# EAGLE design arduino_Uno_ref (EAGLE 9.6.2)
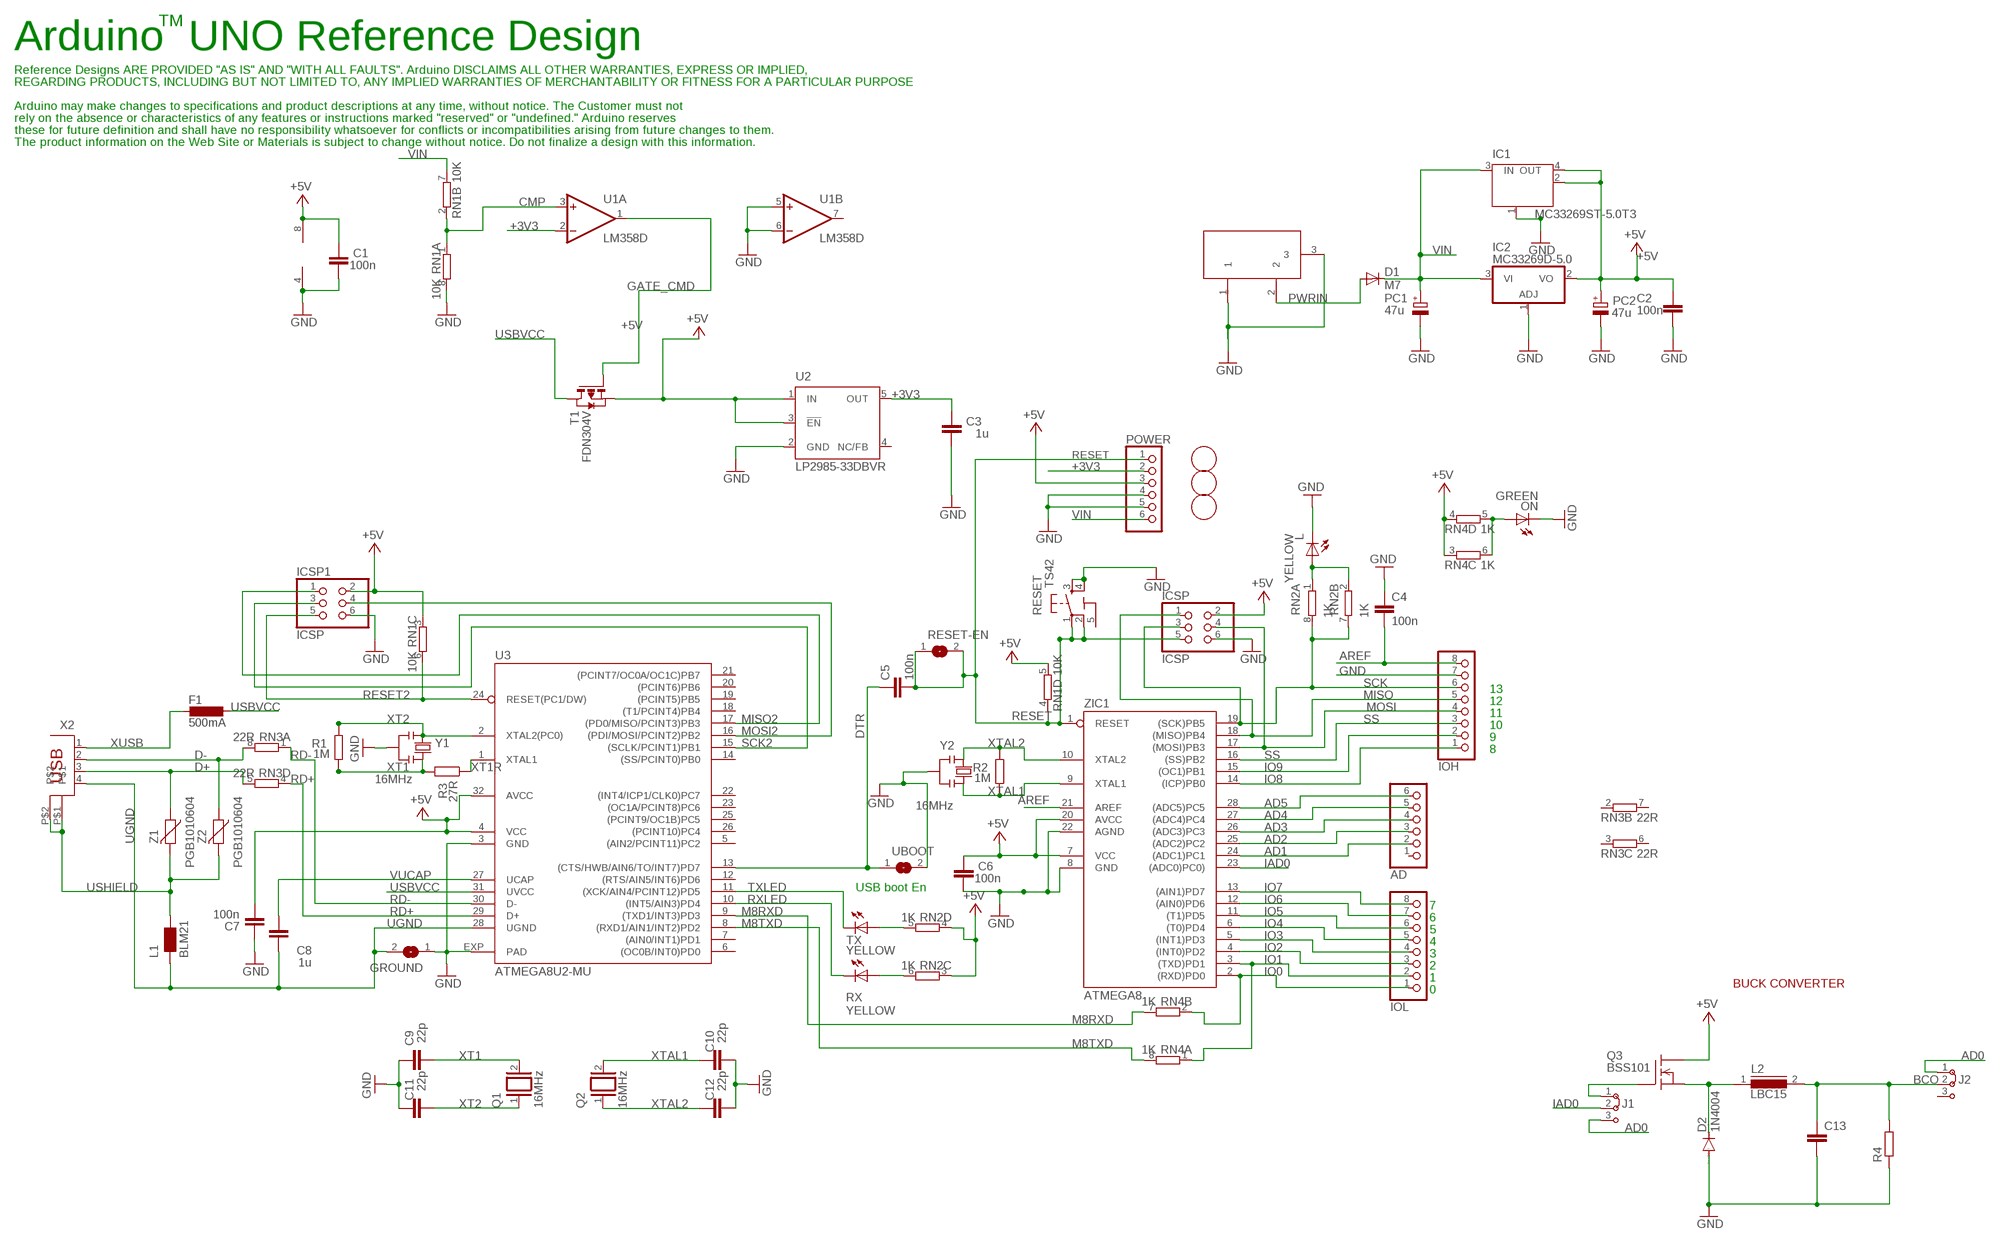
[diagram p0: schematic, sheet 1]

## Parts
AD  PINHD-1X6  [1X06]
C1  100n  C-EU0603-RND  [C0603-ROUND]
C2  100n  C-EU0603-RND  [C0603-ROUND]
C3  1u  C-EU0603-RND  [C0603-ROUND]
C4  100n  C-EU0603-RND  [C0603-ROUND]
C5  100n  C-EU0603-RND  [C0603-ROUND]
C6  100n  C-EU0603-RND  [C0603-ROUND]
C7  100n  C-EU0603-RND  [C0603-ROUND]
C8  1u  C-EU0603-RND  [C0603-ROUND]
C9  22p  C-EU0603-RND  [C0603-ROUND]
C10  22p  C-EU0603-RND  [C0603-ROUND]
C11  22p  C-EU0603-RND  [C0603-ROUND]
C12  22p  C-EU0603-RND  [C0603-ROUND]
C13  C2.5/2  [C2.5-2]
D1  M7  DIODE-SMB  [SMB]
D2  1N4004  [DO41-10]
F1  500mA  L-EUL1812  [L1812]
GROUND  SJ  [SJ]
IC1  MC33269ST-5.0T3  MC33269ST-3.3T3  [SOT223]
IC2  MC33269D-5.0  [DPACK]
ICSP  ICSP  PINHD-2X3  [2X03]
ICSP1  ICSP  PINHD-2X3  [2X03]
IOH  PINHD-1X8  [1X08]
IOL  PINHD-1X8  [1X08]
J1  J2X2MM  [04C]
J2  J2X2MM  [04C]
L  YELLOW  LEDCHIP-LED0805  [CHIP-LED0805]
L1  BLM21  WE-CBF_0805  [0805]
L2  LBC15  [LBC15]
ON  GREEN  LEDCHIP-LED0805  [CHIP-LED0805]
PC1  47u  CPOL-EUD  [PANASONIC_D]
PC2  47u  CPOL-EUD  [PANASONIC_D]
POWER  PINHD-1X6  [1X06]
Q1  16MHz  XTAL/S  [QS]
Q2  16MHz  XTAL/S  [QS]
Q3  BSS101  [TO92]
R1  1M  R-EU_R0603  [R0603-ROUND]
R2  1M  R-EU_R0603  [R0603-ROUND]
R3  27R  R-EU_R0603  [R0603-ROUND]
R4  R-EU_0207/10  [0207/10]
RESET  TS42  [TS42]
RESET-EN  SJ  [SJ]
RN1  10K  4R-NCAY16  [CAY16]
RN2  1K  4R-NCAY16  [CAY16]
RN3  22R  4R-NCAY16  [CAY16]
RN4  1K  4R-NCAY16  [CAY16]
RX  YELLOW  LEDCHIP-LED0805  [CHIP-LED0805]
T1  FDN304V  PMOSSOT23  [SOT-23]
TX  YELLOW  LEDCHIP-LED0805  [CHIP-LED0805]
U1  LM358D  [SO08]
U2  LP2985-33DBVR  TPS77033  [SOT23-DBV]
U3  ATMEGA8U2-MU  [QFN32]
U$3  FIDUCIALMOUNT  [FIDUCIA-MOUNT]
U$4  FIDUCIALMOUNT  [FIDUCIA-MOUNT]
U$6  FIDUCIALMOUNT  [FIDUCIA-MOUNT]
UBOOT  SJ  [SJ]
X1  DC21MMX  [DC-21MM]
X2  PN61729  [PN61729]
Y1  16MHz  RESONATORMU  [RESONATOR]
Y2  16MHz  RESONATORMU  [RESONATOR]
Z1  PGB1010604  VARISTORCN0603  [CT/CN0603]
Z2  PGB1010604  VARISTORCN0603  [CT/CN0603]
ZIC1  ATMEGA8  AT90S4433P  [DIL28-3]

## Nets
+3V3: C3.2 POWER.2 U1.2(A:-IN) U2.5(OUT)
+5V: C1.2 C2.2 C6.2 C7.1 IC1.2(OUT) IC1.4(OUT) IC2.2(VO) ICSP1.2 ICSP.2 PC2.+ POWER.3 Q3.3(D) RN1.3 RN1.5 RN2.3 RN2.4 RN4.3 RN4.4 T1.2(S) U1.8(P:V+) U2.1(IN) U2.3(!EN) U3.4(VCC) U3.32(AVCC) ZIC1.7(VCC) ZIC1.20(AVCC)
AD0: J1.3 J2.1
AD1: AD.2 ZIC1.24((ADC1)PC1)
AD2: AD.3 ZIC1.25((ADC2)PC2)
AD3: AD.4 ZIC1.26((ADC3)PC3)
AD4: AD.5 ZIC1.27((ADC4)PC4)
AD5: AD.6 ZIC1.28((ADC5)PC5)
AREF: C4.2 IOH.8 ZIC1.21(AREF)
BCO: C13.1 J2.2 L2.2 R4.2
CMP: RN1.1 RN1.2 U1.3(A:+IN)
D+: RN3.5 X2.3 Z1.1
D-: RN3.8 X2.2 Z2.1
DTR: C5.1 U3.13((CTS/HWB/AIN6/TO/INT7)PD7) UBOOT.1
GATE_CMD: T1.3(G) U1.1(A:OUT)
GND: C1.1 C2.1 C3.1 C4.1 C6.1 C7.2 C9.2 C10.1 C11.2 C12.1 C13.2 D2.A GROUND.1 IC1.1(GND/ADJ) IC2.1(ADJ) ICSP1.6 ICSP.6 IOH.7 L.C ON.C PC1.- PC2.- POWER.4 POWER.5 R4.1 RESET.3 RESET.4 RN1.8 U1.4(P:V-) U1.5(B:+IN) U1.6(B:-IN) U2.2(GND) U3.3(GND) U3.EXP(PAD) UBOOT.2 X1.1 X1.3 Y1.2 Y2.2 ZIC1.8(GND) ZIC1.22(AGND)
IAD0: J1.2 ZIC1.23((ADC0)PC0))
IO0: IOL.1 RN4.2 ZIC1.2((RXD)PD0)
IO1: IOL.2 RN4.1 ZIC1.3((TXD)PD1)
IO2: IOL.3 ZIC1.4((INT0)PD2)
IO3: IOL.4 ZIC1.5((INT1)PD3)
IO4: IOL.5 ZIC1.6((T0)PD4)
IO5: IOL.6 ZIC1.11((T1)PD5)
IO6: IOL.7 ZIC1.12((AIN0)PD6)
IO7: IOL.8 ZIC1.13((AIN1)PD7)
IO8: IOH.1 ZIC1.14((ICP)PB0)
IO9: IOH.2 ZIC1.15((OC1)PB1)
M8RXD: RN4.7 U3.9((TXD1/INT3)PD3)
M8TXD: RN4.8 U3.8((RXD1/AIN1/INT2)PD2)
MISO: ICSP.1 IOH.5 ZIC1.18((MISO)PB4)
MISO2: ICSP1.1 U3.17((PD0/MISO/PCINT3)PB3)
MOSI: ICSP.4 IOH.4 ZIC1.17((MOSI)PB3)
MOSI2: ICSP1.4 U3.16((PDI/MOSI/PCINT2)PB2)
N$1: J1.1 Q3.2(G)
N$2: L.A RN2.1 RN2.2
N$3: ON.A RN4.5 RN4.6
N$5: D2.C L2.1 Q3.1(S)
N$35: RN2.6 RX.A
N$36: RN2.5 TX.A
PWRIN: D1.A X1.2
RD+: RN3.4 U3.29(D+)
RD-: RN3.1 U3.30(D-)
RESET: C5.2 ICSP.5 POWER.1 RESET-EN.1 RESET-EN.2 RESET.1 RESET.2 RN1.4 ZIC1.1(RESET)
RESET2: ICSP1.5 RN1.6 U3.24(RESET(PC1/DW))
RXLED: RX.C U3.10((INT5/AIN3)PD4)
SCK: ICSP.3 IOH.6 RN2.7 RN2.8 ZIC1.19((SCK)PB5)
SCK2: ICSP1.3 U3.15((SCLK/PCINT1)PB1)
SS: IOH.3 ZIC1.16((SS)PB2)
TXLED: TX.C U3.11((XCK/AIN4/PCINT12)PD5)
UGND: C8.2 GROUND.2 L1.1 U3.28(UGND) X2.4
USBVCC: F1.1 T1.1(D) U3.31(UVCC)
USHIELD: L1.2 X2.P$1 X2.P$2 Z1.2 Z2.2
VIN: D1.C IC1.3(IN) IC2.3(VI) PC1.+ POWER.6 RN1.7
VUCAP: C8.1 U3.27(UCAP)
XT1: C9.1 Q1.2 R1.1 R3.2 Y1.3
XT1R: R3.1 U3.1(XTAL1)
XT2: C11.1 Q1.1 R1.2 U3.2(XTAL2(PC0)) Y1.1
XTAL1: C10.2 Q2.2 R2.1 Y2.3 ZIC1.9(XTAL1)
XTAL2: C12.2 Q2.1 R2.2 Y2.1 ZIC1.10(XTAL2)
XUSB: F1.2 X2.1
Unconnected: AD.1 J2.3 RN3.2 RN3.3 RN3.6 RN3.7 U1.7(B:OUT) U2.4(NC/FB) U3.5((AIN2/PCINT11)PC2) U3.6((OC0B/INT0)PD0) U3.7((AIN0/INT1)PD1) U3.12((RTS/AIN5/INT6)PD6) U3.14((SS/PCINT0)PB0) U3.18((T1/PCINT4)PB4) U3.19((PCINT5)PB5) U3.20((PCINT6)PB6) U3.21((PCINT7/OC0A/OC1C)PB7) U3.22((INT4/ICP1/CLK0)PC7) U3.23((OC1A/PCINT8)PC6) U3.25((PCINT9/OC1B)PC5) U3.26((PCINT10)PC4)

## Notes on the sheet
- TM
- Arduino  UNO Reference Design
- Reference Designs ARE PROVIDED "AS IS" AND "WITH ALL FAULTS". Arduino DISCLAIMS ALL OTHER WARRANTIES, EXPRESS OR IMPLIED,
- REGARDING PRODUCTS, INCLUDING BUT NOT LIMITED TO, ANY IMPLIED WARRANTIES OF MERCHANTABILITY OR FITNESS FOR A PARTICULAR PURPOSE
- Arduino may make changes to specifications and product descriptions at any time, without notice. The Customer must not
- rely on the absence or characteristics of any features or instructions marked "reserved" or "undefined." Arduino reserves
- these for future definition and shall have no responsibility whatsoever for conflicts or incompatibilities arising from future changes to them.
- The product information on the Web Site or Materials is subject to change without notice. Do not finalize a design with this information.
- 13
- 12
- 11
- 10
- 9
- 8
- USB boot En
- 7
- 6
- 5
- 4
- 3
- 2
- 1
- BUCK CONVERTER
- 0

## Power pins joined to a net without a drawn wire
5-GND: RESET.5(5-GND)

## Library data of the parts
AD POWER = pinhead:PINHD-1X6: PIN HEADER
C1-C12 = SmartPrj:C-EU: CAPACITOR, European symbol
C13 = capacitor-wima:C: CAPACITOR naming: grid - package width
D1 = diode:DIODE-: DIODE
D2 = diode:1N4004: DIODE general purpose rectifier, 1 A
F1 = rcl:L-EU: INDUCTOR, European symbol
GROUND RESET-EN UBOOT = jumper:SJ: SMD solder JUMPER
IC1 = linear:MC33269ST*: Adjustable Output Low Dropout Voltage Regulator 800 mA Source: http://www.onsemi.com/pub/Collateral/MC33269-D.PDF
IC2 = linear:MC33269?*: Adjustable Output Low Dropout Voltage Regulator 800 mA Source: http://www.onsemi.com/pub/Collateral/MC33269-D.PDF
ICSP ICSP1 = pinhead:PINHD-2X3: PIN HEADER
IOH IOL = pinhead:PINHD-1X8: PIN HEADER
J1 J2 = jumper:J2: Jumper switch 2 x 2.5 mm
L ON RX TX = led:LED: LED OSRAM: - CHIPLED LG R971, LG N971, LY N971, LG Q971, LY Q971, LO R971, LY R971 LH N974, LH R974 LS Q976, LO Q976, LY Q976 LO Q996 - Hyper CHIPLED LW Q18S LB Q993, LB Q99A, LB R99A - SideLED LS A670, LO A670, LY A670, LG A670, LP A670 LB A673, LV A673, LT A673, LW A673 LH A674 LY A675 LS A676, LA A676, LO A676, LY A676, LW A676 LS A679, LY A679, LG A679 - Hyper Micro SIDELED® LS Y876, LA Y876, LO Y876, LY Y876 LT Y87S - SmartLED LW L88C, LW L88S LB L89C, LB L89S, LG L890 LS L89K, LO L89K, LY L89K LS L896, LA L896, LO L896, LY L896 - TOPLED LS T670, LO T670, LY T670, LG T670, LP T670 LSG T670, LSP T670, LSY T670, LOP T670, LYG T670 LG T671, LOG T671, LSG T671 LB T673, LV T673, LT T673, LW T673 LH T674 LS T676, LA T676, LO T676, LY T676, LB T676, LH T676, LSB T676, LW T676 LB T67C, LV T67C, LT T67C, LS T67K, LO T67K, LY T67K, LW E67C LS E67B, LA E67B, LO E67B, LY E67B, LB E67C, LV E67C, LT E67C LW T67C LS T679, LY T679, LG T679 LS T770, LO T770, LY T770, LG T770, LP T770 LB T773, LV T773, LT T773, LW T773 LH T774 LS E675, LA E675, LY E675, LS T675 LS T776, LA T776, LO T776, LY T776, LB T776 LHGB T686 LT T68C, LB T68C - Hyper Mini TOPLED® LB M676 - Mini TOPLED Santana® LG M470 LS M47K, LO M47K, LY M47K Source: http://www.osram.convergy.de LUXEON: - LUMILED® LXK2-PW12-R00, LXK2-PW12-S00, LXK2-PW14-U00, LXK2-PW14-V00 LXK2-PM12-R00, LXK2-PM12-S00, LXK2-PM14-U00 LXK2-PE12-Q00, LXK2-PE12-R00, LXK2-PE12-S00, LXK2-PE14-T00, LXK2-PE14-U00 LXK2-PB12-K00, LXK2-PB12-L00, LXK2-PB12-M00, LXK2-PB14-N00, LXK2-PB14-P00, LXK2-PB14-Q00 LXK2-PR12-L00, LXK2-PR12-M00, LXK2-PR14-Q00, LXK2-PR14-R00 LXK2-PD12-Q00, LXK2-PD12-R00, LXK2-PD12-S00 LXK2-PH12-R00, LXK2-PH12-S00 LXK2-PL12-P00, LXK2-PL12-Q00, LXK2-PL12-R00 Source: www.luxeon.com KINGBRIGHT: KA-3528ASYC Source: www.kingbright.com
L1 = wuerth-elektronik:WE-CBF: SMD EMI Suppression Ferrite Beads - excellent anti-EMI properties - low DCR - impedances till 3000 ohms - rated current up to 6 A
L2 = inductors:LBC15: INDUCTOR; SPICEPREFIX: L
PC1 PC2 = rcl:CPOL-EU: POLARIZED CAPACITOR, European symbol
Q1 Q2 = special:XTAL/S: CRYSTAL
Q3 = transistor-fet:BSS101: N-Channel Enhancement MOSFET 200V; 0,16A; 11Ohm
R1-R3 = SmartPrj:R-EU_: RESISTOR, European symbol
R4 = rcl:R-EU_: RESISTOR, European symbol; SPICEPREFIX: R
RESET = st-mod v1.4:TS42: TS42 Dongnan Electronics Tact switch VDC 12V - 50mA
RN1-RN4 = resistor-dil:4R-N: Array Chip Resistor Source: RS Component / Phycomp
T1 = zetex:PMOSSOT23: MOS FET
U1 = linear:LM358: OP AMP also LM158; LM258; LM2904 Source: http://cache.national.com/ds/LM/LM158.pdf
U2 = texas:TPS770*: ULTRALOW-POWER 50-mA LOW-DROPOUT LINEAR REGULATORS 50-mA Low-Dropout Regulator Source: http://focus.ti.com/lit/ds/symlink/tps77001.pdf
U3 = atmel:ATMEGA8U2-MU
U$3 U$4 U$6 = SmartPrj:FIDUCIALMOUNT
X1 = powersupply:DC21MM
X2 = SmartPrj:PN61729: BERG USB connector
Y1 Y2 = SmartPrj:RESONATOR
Z1 Z2 = varistor:VARISTOR: VARISTOR
ZIC1 = atmel:AT90S4433: MICROCONTROLLER 4 Kbytes FLASH 128 bytes SRAM 256 bytes EEPROM UART 6-channel 10 bit ADC

## Net classes
0 default: width 0.152 mm, drill 0.305 mm, clearance 0.152 mm
2 gnd: width 0.305 mm, drill 0.483 mm, clearance 0.203 mm
3 usbvcc: width 0.305 mm, drill 0.483 mm, clearance 0.203 mm

## Board
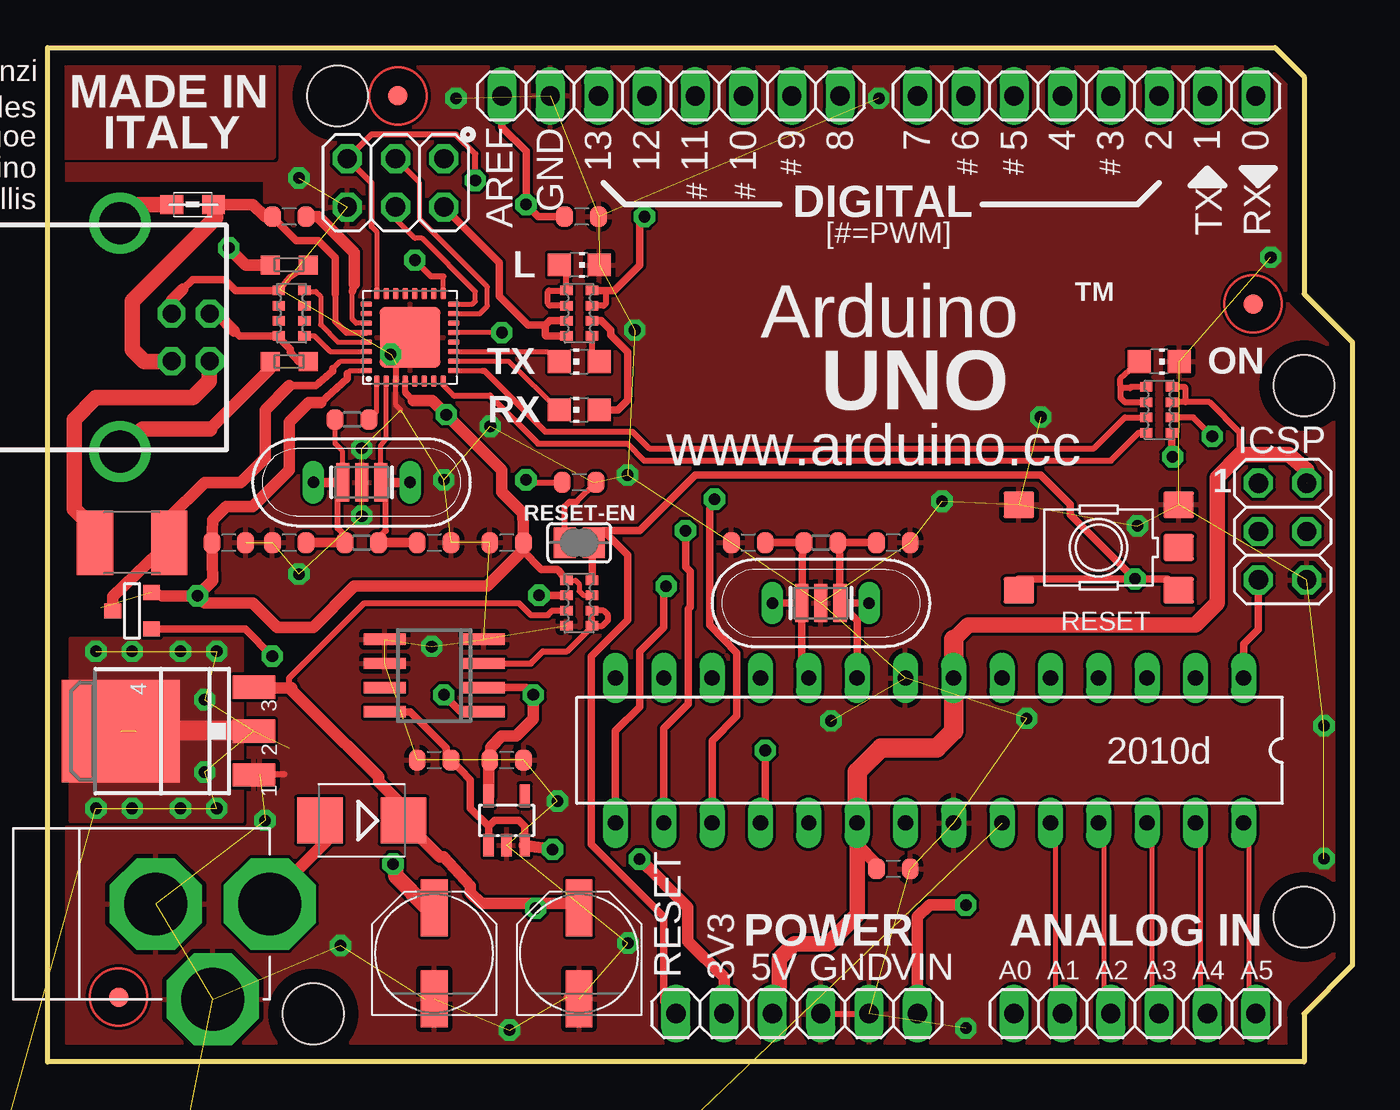
[diagram p1: board, top side]
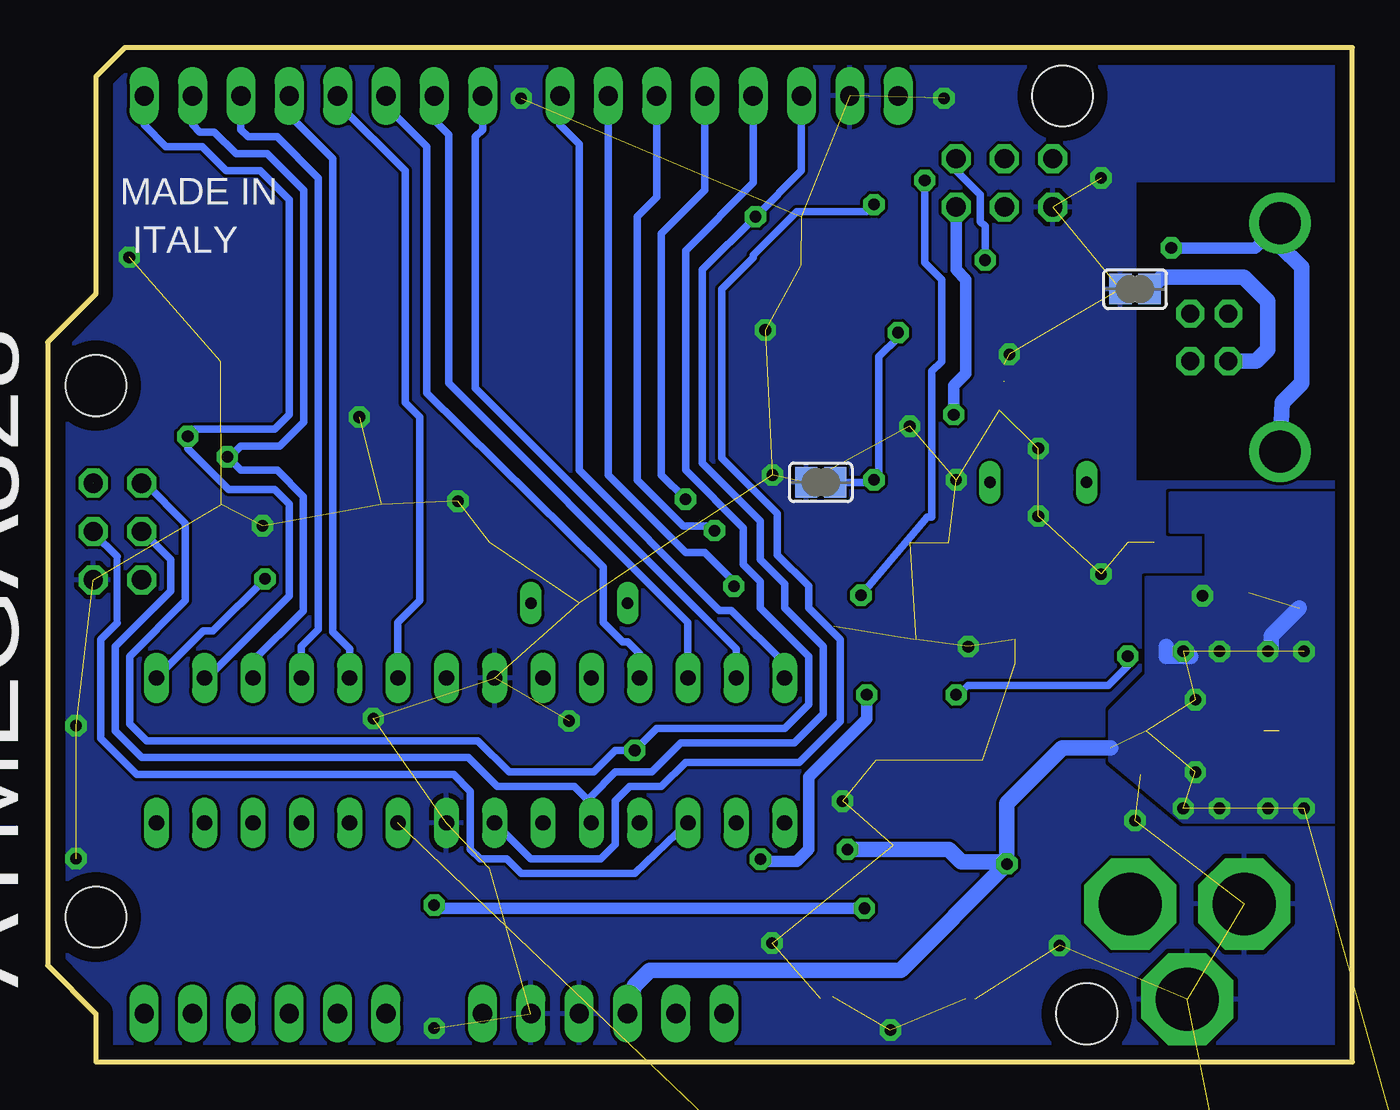
[diagram p2: board, bottom side, seen from below]

Size 68.58 x 53.34 mm. Coordinates in mm from the lower left corner, seen from the top.
Outline: 0,53.34 64.52,53.34 66.04,51.82 66.04,40.39 68.58,37.85 68.58,5.08 66.04,2.54 66.04,0 0,0 0,53.34
Copper layers (1*16): Top 0.035mm / dielectric 1.5mm / Bottom 0.035mm
Design rules "default *": minimum track width 8mil, minimum drill 12mil, track to track 6mil, track to pad 6mil, pad to pad 6mil, via to via 6mil, smd to smd 6mil, copper to edge 30mil, drill to drill 12mil, minimum pad ring 10mil, minimum via ring 10mil, stop-mask expansion 1mil, vias tented up to drill 0mil, thermal gap 10mil
Holes 3.2 mm at 66.04,35.56 66.04,7.62 15.24,50.8 13.97,2.54
vRestrict: area 0.6,21.8 to 2,30.1; area 5.7,22.6 to 7.4,30.1; area 47.9,10.3 to 48.5,10.8; area 50.4,10.2 to 50.9,11; area 11.3,28.8 to 12.7,31.1; area 0.3,12.4 to 9.4,24.5

### Footprints (pad centres in the part's own frame; a part is rotated, then mirrored left to right if it is on the bottom)
1X06 = drill 1.016 long: 1 -6.35,0; 2 -3.81,0; 3 -1.27,0; 4 1.27,0; 5 3.81,0; 6 6.35,0
C0603-ROUND = smd 0.898 x 1.1: 1 -0.889,0; 2 0.889,0
C2.5-2 = drill 0.813 pad 1.6 octagon: 1 -1.27,0; 2 1.27,0
SMB = smd 2.4 x 2.4: A 2.2,0; C -2.2,0
DO41-10 = drill 1.118: A 5.08,0; C -5.08,0
L1812 = smd 1.9 x 3.4: 1 -1.95,0; 2 1.95,0
SJ = smd 1.168 x 1.6: 1 -0.762,0; 2 0.762,0
SOT223 = smd 1.219 x 2.235: 1 -2.311,-3.099; 2 0,-3.099; 3 2.311,-3.099 | smd 3.6 x 2.2: 4 0,3.099
DPACK = smd 1 x 1.6: 1 -2.28,-4.8; 3 2.28,-4.8 | smd 5.4 x 6.2: 2 0,2.5
2X03 = drill 1.016 octagon: 1 -2.54,-1.27; 2 -2.54,1.27; 3 0,-1.27; 4 0,1.27; 5 2.54,-1.27; 6 2.54,1.27
1X08 = drill 1.016 long: 1 -8.89,0; 2 -6.35,0; 3 -3.81,0; 4 -1.27,0; 5 1.27,0; 6 3.81,0; 7 6.35,0; 8 8.89,0
04C = drill 0.813 pad 1.905 octagon: 1 -1.905,0; 2 1.905,0; 3 5.715,0
CHIP-LED0805 = smd 1.2 x 1.2: A 0,-1.05; C 0,1.05
0805 = smd 1.2 x 1: 1 -1.1,0; 2 1.1,0
LBC15 = drill 0.914 long: 1 -7.62,0; 2 7.62,0
PANASONIC_D = smd 3 x 1.4: + 2.4,0; - -2.4,0
QS = drill 0.61 long: 1 -2.54,0; 2 2.54,0
TO92 = drill 0.813 octagon: 1 1.27,0; 2 0,1.905; 3 -1.27,0
R0603-ROUND = smd 0.898 x 1.1: 1 -0.889,0; 2 0.889,0
0207/10 = drill 0.813 octagon: 1 -5.08,0; 2 5.08,0
TS42 = smd 1.6 x 1.4: 1 -4.2,2.25; 2 4.2,2.25; 3 -4.2,-2.25; 4 4.2,-2.25; 5 -4.2,0
CAY16 = smd 0.5 x 0.65: 1 -1.2,-0.675; 2 -0.4,-0.675; 3 0.4,-0.675; 4 1.2,-0.675; 5 1.2,0.675; 6 0.4,0.675; 7 -0.4,0.675; 8 -1.2,0.675
SOT-23 = smd 0.787 x 0.889: 1 0.025,-1.016; 2 -0.94,1.016; 3 0.991,1.016
SO08 = smd 0.6 x 2.2: 1 -1.905,-2.6; 2 -0.635,-2.6; 3 0.635,-2.6; 4 1.905,-2.6; 5 1.905,2.6; 6 0.635,2.6; 7 -0.635,2.6; 8 -1.905,2.6
SOT23-DBV = smd 0.55 x 1.2: 1 -0.95,-1.3; 2 0,-1.3; 3 0.95,-1.3; 4 0.95,1.3; 5 -0.95,1.3
QFN32 = smd 0.6 x 0.3: 1 -2.3,1.75; 2 -2.3,1.25; 3 -2.3,0.75; 4 -2.3,0.25; 5 -2.3,-0.25; 6 -2.3,-0.75; 7 -2.3,-1.25; 8 -2.3,-1.75; 17 2.3,-1.75; 18 2.3,-1.25; 19 2.3,-0.75; 20 2.3,-0.25; 21 2.3,0.25; 22 2.3,0.75; 23 2.3,1.25; 24 2.3,1.75 | smd 0.3 x 0.6: 9 -1.75,-2.3; 10 -1.25,-2.3; 11 -0.75,-2.3; 12 -0.25,-2.3; 13 0.25,-2.3; 14 0.75,-2.3; 15 1.25,-2.3; 16 1.75,-2.3; 25 1.75,2.3; 26 1.25,2.3; 27 0.75,2.3; 28 0.25,2.3; 29 -0.25,2.3; 30 -0.75,2.3; 31 -1.25,2.3; 32 -1.75,2.3 | smd 3.2 x 3.2: EXP 0,0
FIDUCIA-MOUNT = smd 1.016 x 1.016: P$1 0,0
DC-21MM = drill 3.302 pad 4.826 octagon: 1 -5.08,-3.353; 2 -0.076,-6.35; 3 -0.076,-0.356
PN61729 = drill 0.95 octagon: 1 1.25,4.71; 2 -1.25,4.71; 3 -1.25,2.71; 4 1.25,2.71 | drill 2.2: P$1 -6,0; P$2 6,0
RESONATOR = smd 0.7 x 2: 1 -1,0; 2 0,0; 3 1,0
CT/CN0603 = smd 1 x 1: 1 -1,0; 2 1,0
DIL28-3 = drill 0.813 long: 1 -16.51,-3.81; 2 -13.97,-3.81; 3 -11.43,-3.81; 4 -8.89,-3.81; 5 -6.35,-3.81; 6 -3.81,-3.81; 7 -1.27,-3.81; 8 1.27,-3.81; 9 3.81,-3.81; 10 6.35,-3.81; 11 8.89,-3.81; 12 11.43,-3.81; 13 13.97,-3.81; 14 16.51,-3.81; 15 16.51,3.81; 16 13.97,3.81; 17 11.43,3.81; 18 8.89,3.81; 19 6.35,3.81; 20 3.81,3.81; 21 1.27,3.81; 22 -1.27,3.81; 23 -3.81,3.81; 24 -6.35,3.81; 25 -8.89,3.81; 26 -11.43,3.81; 27 -13.97,3.81; 28 -16.51,3.81

### Placement (x,y rotation side)
AD  57.15,2.54 0 top
C1  20.32,15.88 0 top
C2  9.53,27.3 180 top
C3  24.13,15.88 180 top
C4  28.07,44.45 180 top
C5  27.94,30.48 0 top
C6  44.45,10.16 180 top
C7  24.13,27.3 180 top
C8  12.7,44.45 180 top
C9  12.7,27.3 180 top
C10  44.45,27.3 180 top
C11  20.32,27.3 0 top
C12  36.83,27.3 0 top
C13  1.27,-27.3 0 top  (outside the outline)
D1  16.51,12.7 180 top
D2  -7.62,-27.3 0 top  (outside the outline)
F1  4.45,27.3 180 top
GROUND  11.43,40.64 0 bottom
IC1  7.75,17.4 90 top
IC2  6.35,17.4 90 top
ICSP  64.91,27.89 270 top
ICSP1  18.29,46.23 180 top
IOH  32.77,50.8 180 top
IOL  54.61,50.8 180 top
J1  -10.79,-43.81 0 top  (outside the outline)
J2  -10.79,-48.26 0 top  (outside the outline)
L  27.94,41.91 270 top
L1  7.62,45.09 180 top
L2  -4.45,-20.95 0 top  (outside the outline)
ON  58.42,36.83 270 top
PC1  27.94,5.71 90 top
PC2  20.32,5.71 90 top
POWER  39.37,2.54 0 top
Q1  16.51,30.48 180 top
Q2  40.64,24.13 0 top
Q3  -10.79,-38.73 0 top  (outside the outline)
R1  16.51,27.3 0 top
R2  40.64,27.3 180 top
R3  16,33.78 180 top
R4  -7.62,-34.29 0 top  (outside the outline)
RESET  55.24,27.05 180 top
RESET-EN  27.94,27.3 0 top
RN1  27.94,24.13 90 top
RN2  27.94,39.37 270 top
RN3  12.83,39.37 90 top
RN4  58.42,34.29 90 top
RX  27.94,34.29 90 top
T1  4.45,23.75 270 top
TX  27.94,36.83 90 top
U1  20.32,20.32 90 top
U2  24.13,12.7 0 top
U3  19.05,38.1 90 top
U$3  18.41,50.8 0 top
U$4  63.37,39.85 0 top
U$6  3.73,3.41 0 top
UBOOT  27.94,30.48 180 bottom
X1  5.33,8.38 90 top
X2  3.81,38.1 270 top
Y1  16.51,30.48 180 top
Y2  40.64,24.13 0 top
Z1  12.7,41.91 180 top
Z2  12.7,36.83 180 top
ZIC1  46.35,16.38 180 top

### Tracks (layer width: path | path; a pad name or v marks a point on that pad's centre or on a via)
+3V3  (via drill 0.61)
  Top 0.406: U1.2 25.15,19.68 v25.53,19.3
  Top 0.61: POWER.2 35.56,4.45 33.66,6.35 33.66,8.13 v31.11,10.67 31.62,10.16 | U2.5 23.18,15.78 C3.2 23.28,16.55 23.88,17.14 24.64,17.14 25.53,18.03 v25.53,19.3
  Bottom 0.61: v31.11,10.67 30.99,10.54 29.21,10.54 28.57,11.18 28.57,14.99 25.53,18.03 v25.53,19.3
+5V  (via drill 0.61)  (15 unrouted)
  Top 0.254: U3.32 15.9,36.35 15.75,36.2 | RN1.3 28.18,24.53 27.94,24.77 27.94,25.15 27.76,25.33 RN1.5
  Top 0.305: 18.8,35.2 U3.4 | 59.82,34.69 61.07,34.69 62.66,33.1 62.66,31.93 | 59.82,34.69 RN4.3 | RN4.4 59.76,35.49 59.82,35.43 59.82,34.69
  Top 0.356: 19.23,34.77 18.8,35.2
  Top 0.406: RN2.3 26.4,38.97 26.16,38.73 | RN2.4 26.22,38.17 26.16,38.23 26.16,38.73 | 26.16,38.73 25.27,38.73 23.75,40.26 23.75,42.04 ICSP1.2 | 15.75,36.2 15.75,35.94 14.35,34.67 | 42.55,10.16 42.35,10.35 | 23.18,12.38 U2.1 | 23.18,12.38 23.5,12.7 24.77,12.7 25.08,12.38 U2.3 | U1.8 19.05,18.41 20.95,16.51 20.95,16.09 C1.2 22.23,14.82 22.23,13.34 23.18,12.38 | RN1.5 26.87,25.84 26.8,25.91 25.96,25.91 24.98,26.89
  Top 0.508: 11.02,17.42 IC1.2
  Top 0.61: U2.3 25.05,11.4 v26.54,11.18 | C6.2 43.6,10.38 42.55,11.43 | T1.2 6.02,24.51 v7.87,24.51 | v7.87,24.51 8.68,25.31 C2.2 8.68,28.49 9.4,29.21 10.79,29.21 12.7,31.11 12.7,33.66 13.72,34.67 14.35,34.67 | v7.87,24.51 8.26,24.13 10.79,24.13 12.06,22.86 13.97,22.86 16.13,25.02 23.11,25.02 24.98,26.89 C7.1 24.98,28.87 23.88,29.97 23.88,31.11 v20.95,34.04 20.22,34.77 19.23,34.77
  Top 0.813: POWER.3 38.46,4.01 38.46,5.44 39.24,6.22 41.02,6.22 42.55,7.75 42.55,10.16 42.55,11.43 ZIC1.20 | 47.62,22.23 48.39,22.99 60.33,22.99 61.47,24.13 61.47,30.73 62.66,31.93 65.23,31.93 66.17,31.11 66.17,30.44 | PC2.+ 19.95,8.12 18.29,9.78 18.29,10.29 v18.16,10.41
  Top 1.016: IC1.4 5.84,17.4 5.87,17.42 11.02,17.42 | 47.62,22.23 ZIC1.7 47.62,17.4 46.74,16.51 43.81,16.51 42.55,15.24 ZIC1.20
  Bottom 0.61: 20.56,10.53 20.57,10.54 | v4.45,21.59 4.27,21.67 | v20.95,34.04 20.95,35.56 20.32,36.2 20.32,41.15 20.83,41.66 ICSP1.2
  Bottom 0.813: POWER.3 37.74,4.01 36.93,4.83 23.75,4.83 v18.16,10.41 | v8.89,21.59 8.51,21.34 9.78,21.34 9.78,21.84 | 4.27,21.67 4.27,22.4 2.79,23.88 | 12.7,16.51 15.24,16.51 18.16,13.59 v18.16,10.41 | 20.57,10.54 21.21,11.18 v26.54,11.18 | 20.56,10.53 18.27,10.53 v18.16,10.41
  other vias: 2.54,21.59 6.99,21.59 2.54,13.34 4.45,13.34 6.99,13.34 8.89,13.34 8.26,15.24 8.26,19.05
  pour Top (no thermals): 1.91,21.59 2.54,22.23 8.26,22.23 10.16,20.32 10.16,14.61 8.26,12.7 2.54,12.7 1.91,13.34
  pour Bottom (no thermals): 0.89,29.84 9.53,29.84 9.53,27.94 7.62,27.94 7.62,25.4 10.79,25.4 10.79,20.32 12.7,18.41 12.7,15.88 8.89,12.7 0.89,12.7
  pour Top (no thermals): 1.91,21.59 2.54,22.23 8.26,22.23 10.16,20.32 10.16,14.61 8.26,12.7 2.54,12.7 1.91,13.34
  pour Top (no thermals): 1.27,12.7 1.27,22.23 10.16,22.23 10.16,12.7
AD0  (1 unrouted)
AD1
  Top 0.254: ZIC1.24 52.98,12.17 52.98,3 AD.2
AD2
  Top 0.254: ZIC1.25 55.52,12.17 55.52,3 AD.3
AD3
  Top 0.254: ZIC1.26 58.06,12.17 58.06,3 AD.4
AD4
  Top 0.254: ZIC1.27 60.6,12.17 60.6,3 AD.5
AD5
  Top 0.254: ZIC1.28 63.14,12.17 63.14,3 AD.6
AREF  (via drill 0.61)
  Top 0.406: IOH.8 23.88,49.15 25.15,47.88 v25.15,45.09 25.78,44.45 C4.2
  Bottom 0.406: ZIC1.21 43.18,10.67 39.5,10.67 38.73,11.43 38.73,13.72 37.97,14.48 36.32,14.48 35.05,15.75 29.08,15.75 26.92,17.91 26.92,22.23 28.57,23.88 28.57,25.02 30.23,26.67 30.23,28.83 33.15,31.75 33.15,40.64 31.5,42.29 31.5,42.42 29.21,44.7 25.53,44.7 v25.15,45.09
BCO  (3 unrouted)
CMP
  Top 0.305: U1.3 25.4,20.95 26.04,21.59 27.3,21.59 28.57,22.86 28.57,23.52 RN1.1 29.15,22.93 29.46,23.24 29.46,23.5 29.23,23.73 RN1.2
D+
  Top 0.305: Z1.1 12.73,41.27 RN3.5
  Top 0.406: 7.11,40.64 7.62,41.15 9.31,41.15 9.89,40.57 RN3.5
  Top 0.61: X2.3 6.52,40.05 7.11,40.64
D-
  Top 0.406: Z2.1 13.21,36.83 12.75,37.34 12.75,37.49 12.19,38.02 12.1,38.1 RN3.8 10.09,38.17 9.82,38.44
  Top 0.61: X2.2 8.91,39.35 9.82,38.44
DTR  (via drill 0.61)
  Top 0.254: U3.13 23.75,38.35 v23.88,38.35
  Top 0.305: C5.1 25.27,30.48 v25.15,30.61
  Bottom 0.406: v23.88,38.35 23.88,38.1 24.89,37.08 24.89,30.86 v25.15,30.61 25.27,30.48 UBOOT.1
GATE_CMD  (via drill 0.61)
  Top 0.406: U1.1 21.72,18.41 v20.83,19.3 | v11.81,21.34 10.39,22.76 T1.3
  Bottom 0.406: v11.81,21.34 11.81,20.83 12.83,19.81 20.19,19.81 v20.83,19.3
GND  (via drill 0.61)  (64 unrouted)
  Top 0.203: U3.EXP 18.92,38.1 v18.03,37.21
  Top 0.254: 18.55,34.28 18.3,34.53 U3.3
  Top 0.305: POWER.4 POWER.5 | IC2.1 12.45,15.14 IC1.1 | 19.86,3.3 PC2.- | 18.31,35.81 18.31,36.7
  Top 0.406: 27.3,3.43 PC1.-
  Bottom 0.305: GROUND.1 10.79,40.64
  other vias: 30.51,6.25 26.8,13.72 20.83,30.61 15.39,6.12 23.27,33.43 52.2,33.91 30.86,38.48 11.43,12.7 41.17,17.93 51.46,18.06 30.48,30.86 43.69,50.67 48.26,1.78 16.51,28.7 57.28,28.19 24.28,1.68 67.08,10.69 64.29,42.32 13.21,25.65 67.08,17.68 20.19,21.84 13.21,46.48 21.46,50.67 47.02,29.49 16.51,32.26
  pour Bottom (rank 2): 0.64,52.7 67.69,52.7 67.94,52.45 67.94,0.64 0.89,0.64 0.64,0.89 0.64,30.48 11.43,30.48 11.43,46.35 0.64,46.35
  pour Top (rank 2): 0.64,52.7 67.94,52.7 67.94,0.64 0.64,0.64 0.64,30.48 11.43,30.48 11.43,46.35 0.64,46.35
IAD0  (1 unrouted)
IO0  (via drill 0.61)
  Top 0.305: RN4.2 60.22,33.89 v61.21,32.89
  Bottom 0.406: ZIC1.2 60.2,20.19 55.88,24.51 55.88,29.34 56.64,30.1 59.05,30.1 61.21,32.26 v61.21,32.89 60.83,33.27 56.64,33.27 55.88,34.04 55.88,45.34 57.4,46.86 59.18,46.86 60.45,48.13 62.36,48.13 63.5,49.28 IOL.1
IO1  (via drill 0.61)
  Top 0.406: RN4.1 59.09,31.86 v59.13,31.83
  Bottom 0.406: ZIC1.3 57.78,21.08 55.14,23.72 55.14,29.74 56.52,31.11 58.42,31.11 v59.13,31.83 59,31.95 58.85,31.95 58.42,32.38 56.39,32.38 55.12,33.66 55.12,45.85 57.02,47.75 58.67,47.75 59.82,48.9 60.58,48.9 60.96,49.28 IOL.2 60.96,50.55
IO2
  Bottom 0.406: ZIC1.4 55.24,21.84 54.36,22.73 54.36,46.48 56.52,48.64 58.04,48.64 58.42,49.02 IOL.3 58.42,50.42
IO3
  Bottom 0.406: ZIC1.5 52.7,21.72 53.59,22.61 53.59,47.5 55.88,49.78 IOL.4
IO4
  Bottom 0.406: IOL.5 53.21,50.29 49.78,46.86 49.78,34.67 49.02,33.91 49.02,24.26 50.16,23.11 ZIC1.6
IO5
  Bottom 0.406: IOL.6 50.8,50.29 48.64,48.13 48.64,35.18 39.37,26.04 39.37,23.11 38.35,22.1 38.1,22.1 37.47,21.46 ZIC1.11
IO6
  Bottom 0.406: IOL.7 48.26,49.53 47.5,48.77 47.5,35.69 34.92,23.11 ZIC1.12
IO7
  Bottom 0.406: IOL.8 45.72,49.02 46.1,48.64 46.1,35.43 32.38,21.72 ZIC1.13
IO8
  Bottom 0.406: ZIC1.14 29.84,20.95 32.64,23.75 33.27,23.75 40.64,31.11 40.64,48.26 41.66,49.28 IOH.1
IO9  (via drill 0.61)
  Top 0.406: ZIC1.15 29.84,17.4 31.11,18.67 31.11,21.59 32.38,22.86 32.38,24.89 v32.51,25.02
  Bottom 0.406: v32.51,25.02 32.51,25.27 34.04,26.8 35.05,26.8 39.12,30.86 IOH.2
M8RXD
  Top 0.254: U3.9 22.86,36.35
  Top 0.305: RN4.7 56.62,33.89 54.99,32.26 31.62,32.26 30.73,33.15 26.16,33.15 22.96,36.35 22.86,36.35
M8TXD
  Top 0.254: U3.8 20.8,35.59 21.34,35.05
  Top 0.305: RN4.8 57.35,33.09 55.88,31.62 31.37,31.62 30.48,32.51 25.78,32.51 23.24,35.05 21.34,35.05
MISO  (via drill 0.61)
  Top 0.406: v37.72,16.38 37.72,12.83 ZIC1.18
  Bottom 0.406: IOH.5 31.5,46.23 35.05,42.67 35.05,31.11 32,28.07 32,26.16 31.11,25.27 31.11,23.88 28.57,21.34 28.57,18.8 29.84,17.53 36.58,17.53 v37.72,16.38 | ICSP.1 63.45,30.43 61.34,28.32 61.34,24.26 64.26,21.34 64.26,17.78 63.37,16.89 45.97,16.89 44.32,15.24 39.88,15.24 38.73,16.38 v37.72,16.38 | v37.72,16.38 37.85,16.13 37.85,16.26
MISO2  (via drill 0.61)
  Top 0.254: U3.17 20.8,41.3
  Top 0.305: 20.8,41.3 20.16,41.3 v19.3,42.16
  Bottom 0.406: v19.3,42.16 19.3,43.94 19.56,44.2 19.56,45.59 20.83,46.86 ICSP1.1
MOSI  (via drill 0.61)
  Top 0.406: ZIC1.17 34.92,16.89 36.22,18.19 36.22,21.51 34.8,22.99 34.8,29.08 35.05,29.34 v35.05,29.59
  Bottom 0.381: 64.92,23.09 64.92,26.57
  Bottom 0.406: IOH.4 34.04,45.85 36.32,43.56 36.32,30.86 v35.05,29.59 | ICSP.4 66.18,27.83 64.92,26.57 | 64.92,23.09 65.79,22.23 65.79,17.02 63.88,15.11 47.24,15.11 46.35,14.22 46.35,11.18 45.85,10.67 44.45,10.67 43.69,9.91 37.72,9.91 ZIC1.17
MOSI2
  Top 0.254: U3.16 22.32,39.85 22.48,40.01 22.48,40.51 19.68,43.31 19.3,43.31 18.29,44.32 ICSP1.4
N$1  (1 unrouted)
N$2
  Top 0.305: L.A 27.27,41.53 RN2.1 26.35,40.57 26.29,40.51 26.29,39.88 26.4,39.77 RN2.2
N$3
  Top 0.305: RN4.6 56.62,34.69 56.39,34.92 56.39,35.56 | 56.39,35.56 56.39,35.94 ON.A | RN4.5 56.95,35.49 56.9,35.43 56.52,35.43 56.39,35.56
N$5  (2 unrouted)
N$27
  pour Top: 0.64,52.58 11.81,52.58 11.81,47.62 0.64,47.62
N$35
  Top 0.406: RX.A 29.97,34.29 30.48,34.8 30.48,37.34 29.59,38.23 29.59,38.48 29.1,38.97 RN2.6
N$36
  Top 0.305: RN2.5 28.61,37.2 TX.A
PWRIN
  Top 0.61: D1.A 14.68,11.63 13.21,10.16 X1.2
RD+
  Top 0.254: U3.29 15.26,37.85 14.35,38.76 14.35,40.26 14.1,40.51 13.56,40.51 RN3.4
RD-
  Top 0.254: U3.30 14.86,37.35 14.04,38.17 RN3.1
RESET  (via drill 0.61)
  Top 0.305: RESET-EN.1 27.18,29.21 27.43,29.46 27.81,29.46 C5.2 | 29.84,27.94 29.86,27.92
  Top 0.406: RESET-EN.2 RESET-EN.1 | ICSP.5 63.64,22.75 62.87,21.97 ZIC1.1 | 29.21,27.94 RESET-EN.2 | 29.21,27.94 29.84,27.94 31.11,27.94 34.04,30.86 52.2,30.86 53.76,29.3 53.76,28.79 v57.15,25.4 | v57.15,25.4 58.85,25.4 RESET.1 | POWER.1 32.38,3.17 32.38,7.62 28.57,11.43 28.57,21.34 30.48,23.24 30.48,26.67 29.21,27.94 | v57.15,25.4 51.05,25.4 RESET.2 | RN1.4 28.61,27.85 RESET-EN.2
  Bottom 0.406: ZIC1.1 60.4,22.66 59.89,22.66 v57.15,25.4
RESET2  (via drill 0.61)
  Top 0.254: U3.24 17.3,43.66 17.02,43.94
  Top 0.305: v22.48,46.35 22.48,47.75 21.46,48.77 17.02,48.77 ICSP1.5 17.02,46.23 17.02,43.94
  Top 0.406: RN1.6 v25.84,24.53 v25.83,24.54
  Bottom 0.406: v22.48,46.35 22.48,42.04 21.59,41.15 21.59,36.83 22.1,36.32 22.1,28.65 22.35,28.65 v25.83,24.54
RXLED
  Top 0.254: U3.10 24.24,36.85 RX.C
SCK  (via drill 0.61)
  Top 0.305: RN2.7 29.23,39.77 29.34,39.88 29.34,40.57
  Top 0.406: RN2.8 29.34,40.57 29.77,40.57 31.11,41.91 31.11,44.2 v31.37,44.45
  Bottom 0.406: 40.01,13.46 ZIC1.19 40.01,13.59 | ICSP.3 63.58,27.89 62.1,26.42 62.1,24.77 65.02,21.84 65.02,17.4 63.63,16 46.48,16 44.96,14.48 40.89,14.48 40.01,13.59 | 40.01,13.59 40.01,13.97 38.73,15.24 36.83,15.24 35.31,16.76 29.34,16.76 27.81,18.29 27.81,21.84 29.84,23.88 29.84,25.15 31.11,26.42 31.11,28.45 34.16,31.5 34.16,41.66 v31.37,44.45 28.96,46.86 IOH.6
SCK2
  Top 0.254: U3.15 22.71,39.35 23.11,39.75 23.11,40.77 19.56,44.32 19.56,46.23 ICSP1.3
SS  (via drill 0.61)
  Top 0.406: v33.53,27.94 33.53,26.04 33.78,25.78 33.78,23.93 33.68,23.82 33.68,18.82 32.38,17.53 ZIC1.16
  Bottom 0.406: v33.53,27.94 33.78,28.19 35.18,28.19 37.59,30.61 37.59,44.45 36.58,45.47 IOH.3
TXLED
  Top 0.254: U3.11 26.28,37.35 TX.C
UGND
  Top 0.305: 15.11,40.39 15.11,38.94 15.7,38.35 U3.28
  Top 0.406: 15.11,40.39 15.11,42.29 14.22,43.18 13.08,43.18 C8.2
  Top 0.61: L1.1 10.79,45.09 11.43,44.45 C8.2
  Top 0.813: L1.1 8.85,44.41 4.45,40.01 4.45,37.47 5.08,36.83 6.5,36.83 X2.4
  Bottom 0.813: X2.4 5.06,36.85 4.45,37.47 4.45,40.01 5.71,41.27 10.03,41.27 GROUND.2
USBVCC
  Top 0.254: U3.31 15.39,36.85 14.99,36.45
  Top 0.406: 14.99,36.45 14.99,36.32 14.1,35.56 12.7,35.56
  Top 0.61: 12.7,35.56 11.43,34.29 11.43,31.75 10.16,30.48 8.26,30.48 6.35,28.57 6.35,27.35 F1.1 3.43,24.47 T1.1
USHIELD  (via drill 0.61)
  Top 0.61: Z1.2 10.41,41.91 v9.53,42.8 | Z2.2 11.7,36.47 8.53,33.29
  Top 0.813: L1.2 4.79,45.09 X2.P$1 | 8.53,33.29 5,33.29 X2.P$2
  Bottom 0.61: v9.53,42.8 5.11,42.8 X2.P$1
  Bottom 0.813: X2.P$2 3.68,34.67 2.67,35.69 2.67,41.78 3.81,42.93 X2.P$1
VIN  (via drill 0.61)
  Top 0.305: 12.7,19.68 12.7,20.18 16.65,24.13 24.77,24.13 25.4,23.5 26.29,23.5 26.52,23.73 RN1.7
  Top 0.61: PC1.+ 27.25,8.33 25.91,8.33 v25.65,8.08 25.4,8.33 22.78,8.33 22.23,8.89 22.23,9.27 20.83,10.79 20.61,10.79 D1.C 19.05,12.7 18.41,13.34 18.41,13.72 17.4,14.73 17.4,14.99 13.97,18.41 12.7,19.68 | v48.26,8.26 46.35,8.26 45.72,7.62 POWER.6 | IC1.3 11.75,19.71 IC2.3 12.7,19.68 | 12.7,19.68 12.84,19.68 12.7,19.68
  Bottom 0.61: v25.65,8.08 48.08,8.08 v48.26,8.26
VUCAP
  Top 0.254: U3.27 16.22,38.85 16,39.06 16,40.51
  Top 0.406: 16,40.51 16.13,40.89
  Top 0.61: 16.13,40.89 16.13,42.55 14.22,44.45 C8.1
XT1
  Top 0.254: Y1.3 15.51,32.12 15.11,32.51 R3.2
  Top 0.305: R1.1 15.66,27.65 15.24,28.07 15.24,29.84 15.51,30.11 Y1.3
  Top 0.508: C9.1 R1.1 | Y1.3 Q1.2
XT1R
  Top 0.254: 17.3,35.84 U3.1 17.3,34.19 R3.1
XT2
  Top 0.254: U3.2 17.8,32.75 17.51,32.4 Y1.1
  Top 0.305: R1.2 17.36,27.52 17.78,27.94 17.78,29.84 17.51,30.11 Y1.1
  Top 0.508: R1.2 C11.1 | Y1.1 Q1.1
XTAL1
  Top 0.406: Y2.3 41.64,26.65 R2.1 C10.2 | ZIC1.9 42.55,23.23 Y2.3 | Y2.3 Q2.2
XTAL2
  Top 0.406: Y2.1 39.64,20.56 ZIC1.10 | Y2.1 39.66,24.15 39.66,26.54 R2.2 C12.2 | Y2.1 Q2.1
XUSB
  Top 0.813: F1.2 2.5,27.98 1.4,29.08 1.4,33.78 2.54,34.92 7.62,34.92 8.51,35.81 X2.1

### Text on the board
tPlace: MADE IN | 13 | 12 | 11 | 10 | 9 | 8 | 7 | 6 | 5 | 4 | 3 | 2 | 1 | 0 | ITALY | 2010d
tNames: M.Banzi | D.Cuartielles | T.Igoe | AREF | GND | G.Martino | # | # | # | # | D.Mellis | # | # | DIGITAL | [#=PWM] | TX | RX | TM | TX | Arduino | RX | UNO | www.arduino.cc | 1 | ANALOG IN | RESET | 3V3 | 5V | GND | VIN | A0 | A1 | A2 | A3 | A4 | A5
bNames: MADE IN | ITALY | ATMEGA328
ReferenceLC: L | TX | RX | PC1 | PC2
tDocu: TM | Arduino UNO Reference Design | ARDUINO is a registered trademark by Arduino LLC, Boston, MA, USA | Reference Designs ARE PROVIDED "AS IS" AND "WITH ALL FAULTS". Arduino DISCLAIMS ALL OTHER WARRANTIES, EXPRESS OR IMPLIED, | REGARDING PRODUCTS, INCLUDING BUT NOT LIMITED TO, ANY IMPLIED WARRANTIES OF MERCHANTABILITY OR FITNESS FOR A PARTICULAR PURPOSE | Arduino may make changes to specifications and product descriptions at any time, without notice. The Customer must not | rely on the absence or characteristics of any features or instructions marked "reserved" or "undefined." Arduino reserves | these for future definition and shall have no responsibility whatsoever for conflicts or incompatibilities arising from future changes to them. | The product information on the Web Site or Materials is subject to change without notice. Do not finalize a design with this information.
214bmp: D:/SmartProjects/Snc/a4_bn_logo2.bmp